# EAGLE design TVMC (EAGLE 4.13)
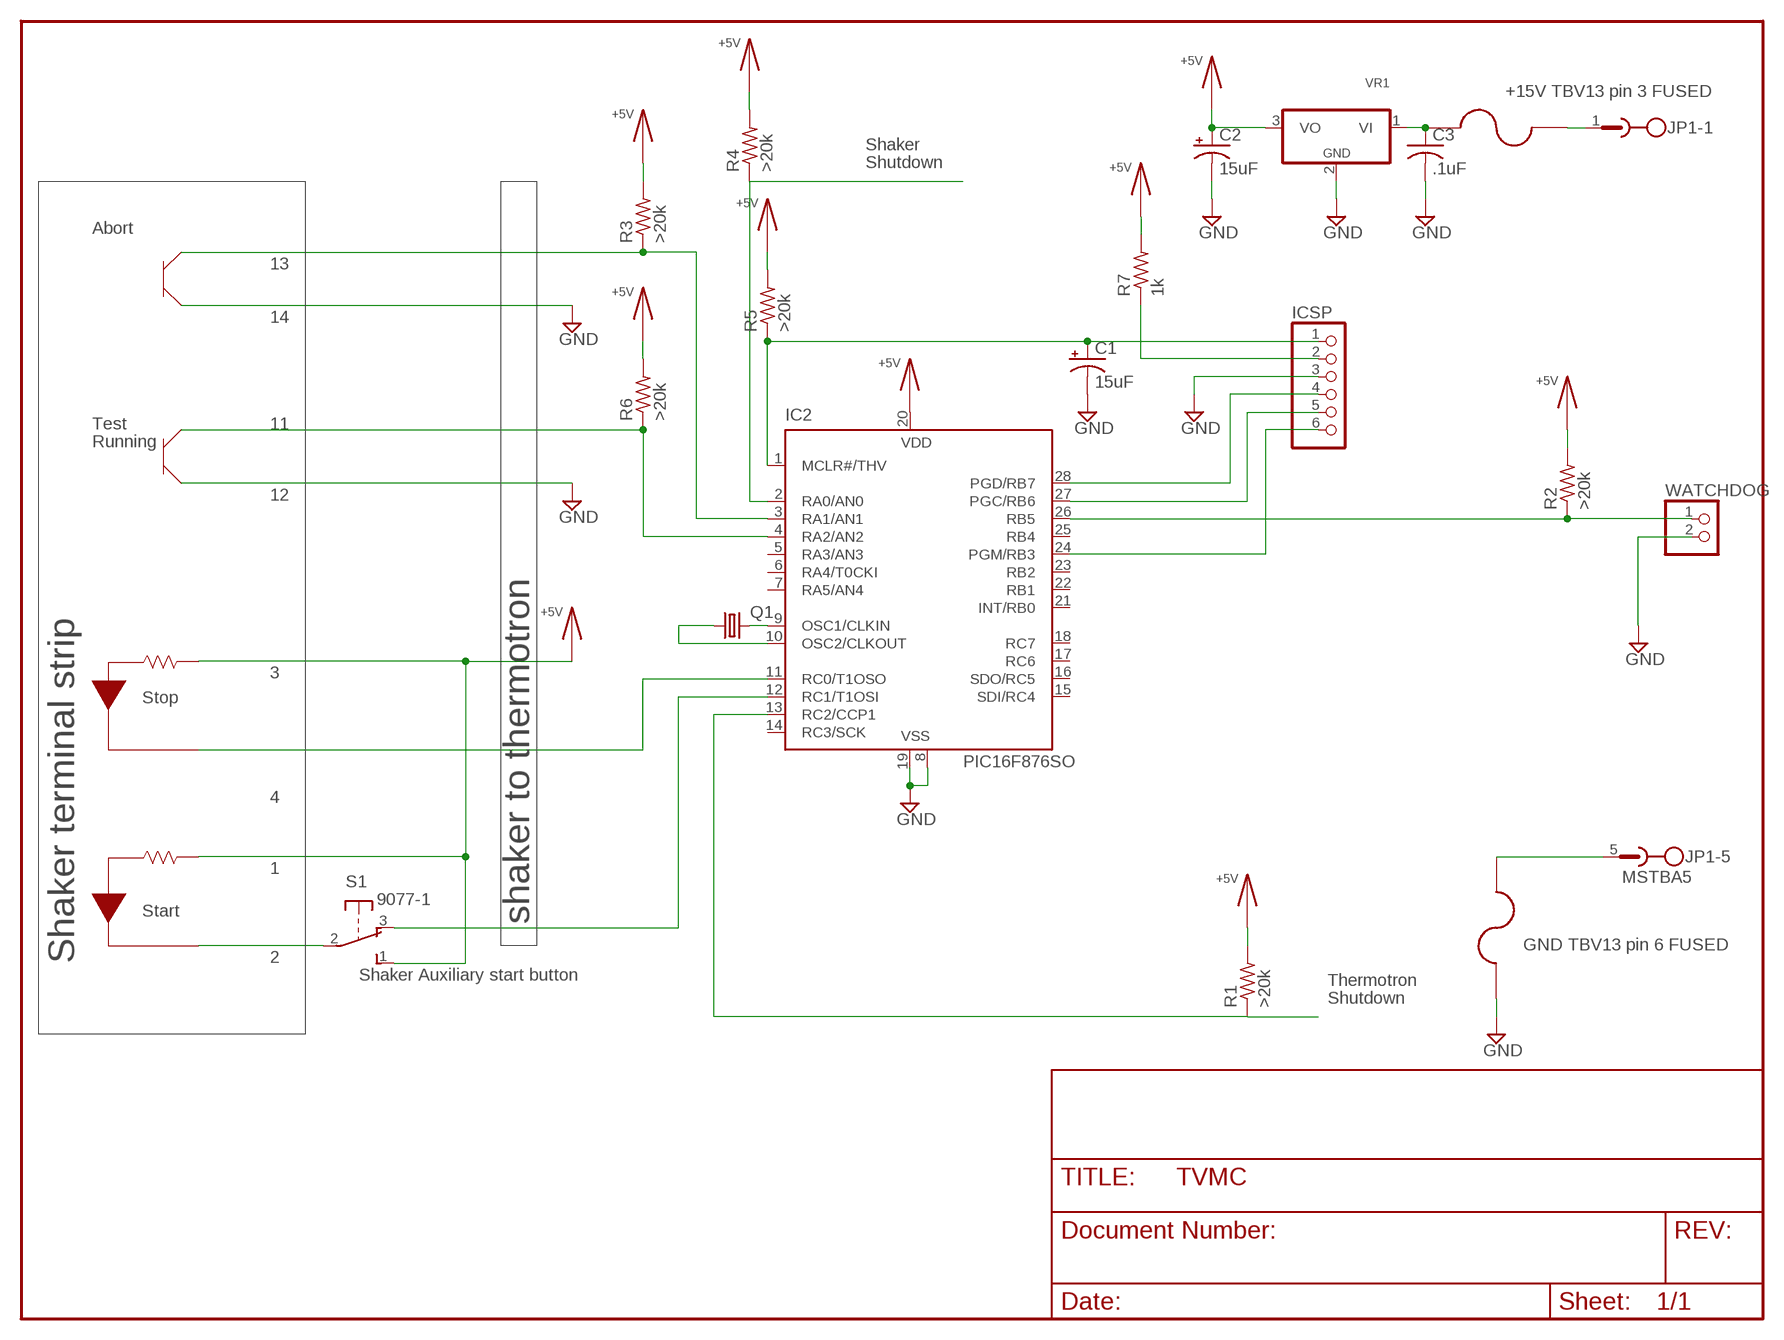
[diagram p0: schematic, sheet 1]

## Parts
C1  15uF  CAPACITOR-ELECTROLYTICG  [PANASONIC_G]
C2  15uF  CAPACITOR-ELECTROLYTICG  [PANASONIC_G]
C3  .1uF  CAPACITOR-NO-POLARITYC1206  [C1206]
IC2  PIC16F876SO  [SO-28W]
ICSP  PINHD-1X6  [1X06]
JP1  MSTBA5  [MSTBA5]
Q1  CRYSTALSM49  [SM49]
R1  >20k  RESISITORM1206  [M1206]
R2  >20k  RESISITORM1206  [M1206]
R3  >20k  RESISITORM1206  [M1206]
R4  >20k  RESISITORM1206  [M1206]
R5  >20k  RESISITORM1206  [M1206]
R6  >20k  RESISITORM1206  [M1206]
R7  1k  RESISITORM1206  [M1206]
S1  9077-1  [9077-1]
U$1  1/2 amp  FUSE(SM)  [FUSE]
U$3  FUSE(SM)  [FUSE]
VR1  VOLTAGE-REGULATORSO-223  [SOT223R_INFINEON]
WATCHDOG  PINHD-1X2  [1X02]

## Nets
14: IC2.3(RA1/AN1) R3.1
+5V: C2.+ IC2.20(VDD) R1.2 R2.2 R3.2 R4.2 R5.2 R6.2 R7.2 S1.1(S) VR1.3(VO)
GND: C1.- C2.- C3.2 IC2.8(VSS) IC2.19(VSS) ICSP.3 U$3.P$1 VR1.2(GND) WATCHDOG.2
N$1: IC2.2(RA0/AN0) R4.1
N$2: IC2.12(RC1/T1OSI) S1.3(O)
N$3: IC2.13(RC2/CCP1) R1.1
N$4: IC2.26(RB5) R2.1 WATCHDOG.1
N$5: IC2.4(RA2/AN2) R6.1
N$6: IC2.11(RC0/T1OSO)
N$7: IC2.9(OSC1/CLKIN) Q1.2
N$8: S1.2(P)
N$9: C3.1 U$1.P$1 VR1.1(VI)
N$10: IC2.10(OSC2/CLKOUT) Q1.1
N$12: C1.+ IC2.1(MCLR#/THV) ICSP.1 R5.1
N$13: ICSP.2 R7.1
N$14: JP1.5 U$3.P$2
N$15: JP1.1 U$1.P$2
N$16: IC2.28(PGD/RB7) ICSP.4
N$17: IC2.27(PGC/RB6) ICSP.5
N$18: IC2.24(PGM/RB3) ICSP.6
Unconnected: IC2.5(RA3/AN3) IC2.6(RA4/T0CKI) IC2.7(RA5/AN4) IC2.14(RC3/SCK) IC2.15(SDI/RC4) IC2.16(SDO/RC5) IC2.17(RC6) IC2.18(RC7) IC2.21(INT/RB0) IC2.22(RB1) IC2.23(RB2) IC2.25(RB4) JP1.2 JP1.3 JP1.4

## Notes on the sheet
- +15V TBV13 pin 3 FUSED
- Shaker
- Shutdown
- Abort
- 13
- 14
- Test | 11
- Running
- 12
- 3
- Stop
- 4
- 1
- Start
- shaker to thermotron
- GND TBV13 pin 6 FUSED
- Shaker terminal strip | 2
- Shaker Auxiliary start button
- Thermotron
- Shutdown

## Library data of the parts
C1 C2 = 1 Dan's Common Parts:CAPACITOR-ELECTROLYTIC: POLARIZED CAPACITOR, American symbol
C3 = 1 Dan's Common Parts:CAPACITOR-NO-POLARITY: CAPACITOR, American symbol
IC2 = 1 Dan's Common Parts:PIC16*876: MICROCONTROLLER flash type
ICSP = pinhead:PINHD-1X6: PIN HEADER
JP1 = con-phoenix-508:MSTBA5: PHOENIX
Q1 = 1 Dan's Common Parts:CRYSTAL: CRYSTAL
R1-R7 = 1 Dan's Common Parts:RESISITOR: RESISTOR, American symbol
S1 = switch-misc:9077-1: MARQUARDT SWITCH
U$1 U$3 = 1 Dan's Common Parts:FUSE(SM)
VR1 = 1 Dan's Common Parts:VOLTAGE-REGULATOR: Positive VOLTAGE REGULATOR Source: http://cache.national.com/ds/LM/LM78L05.pdf http://www.fairchildsemi.com/ds/LM/LM7805.pdf
WATCHDOG = pinhead:PINHD-1X2: PIN HEADER

## Board
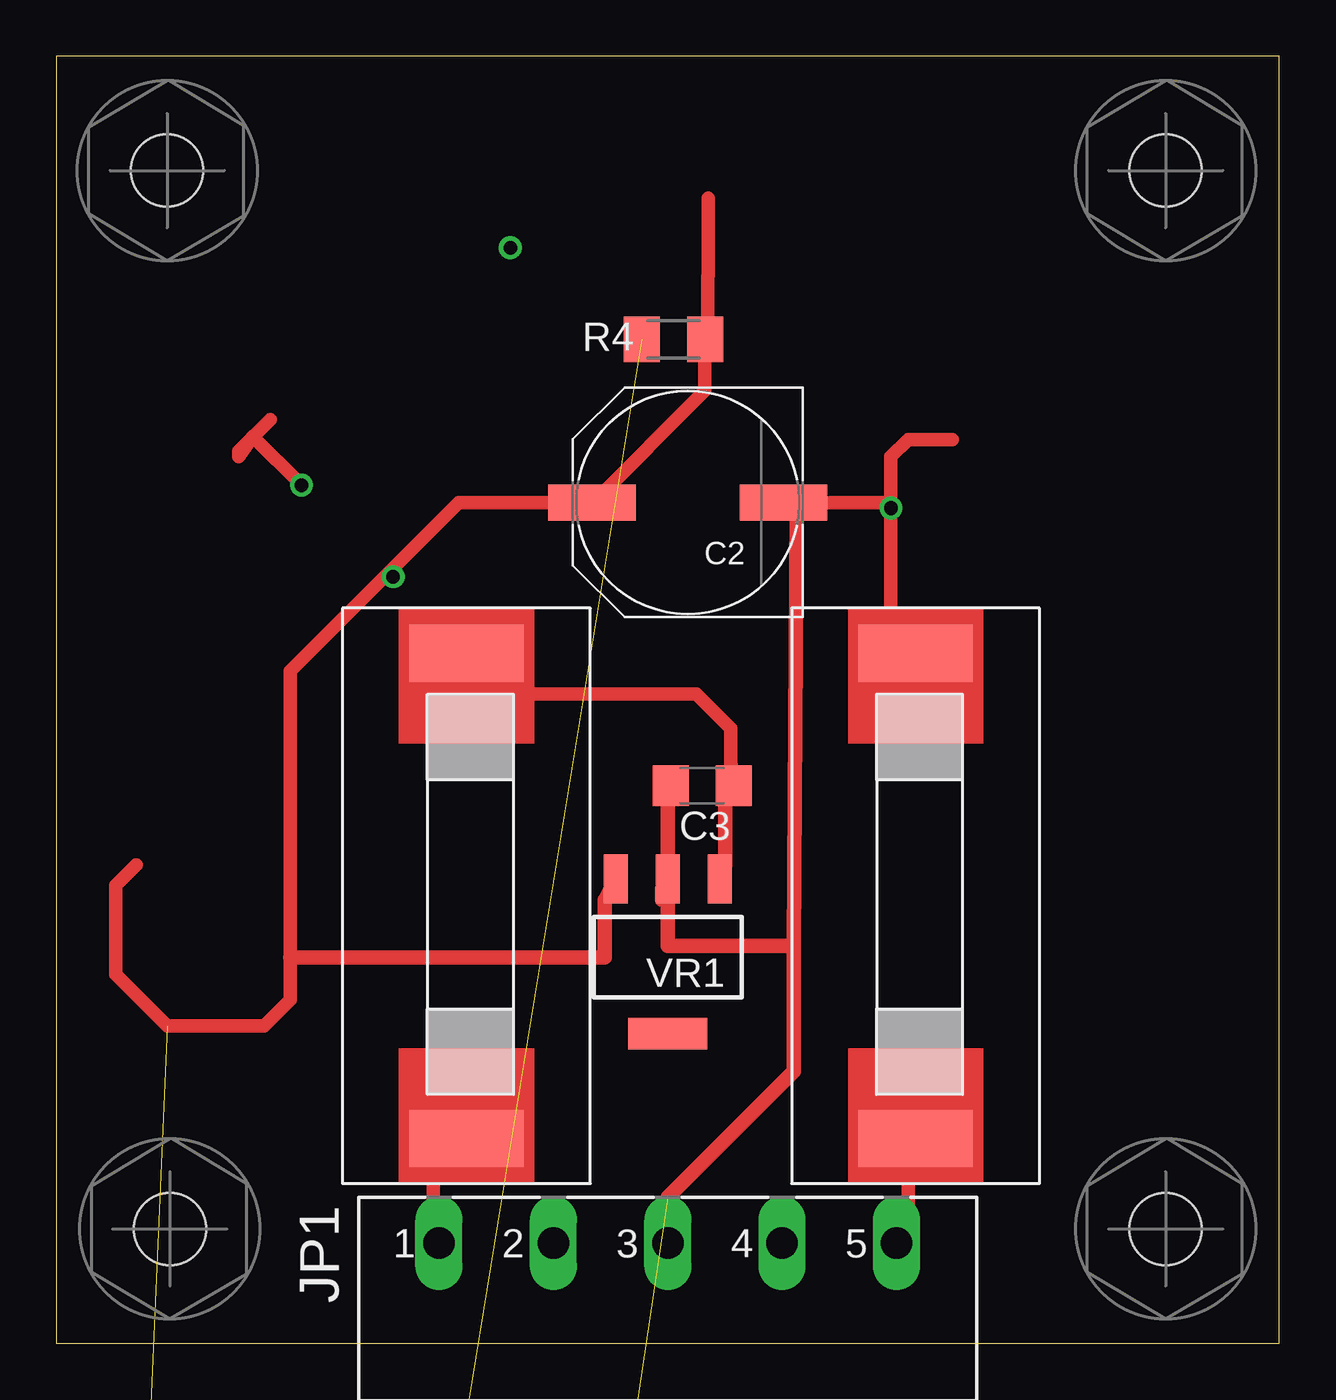
[diagram p1: board, top side]
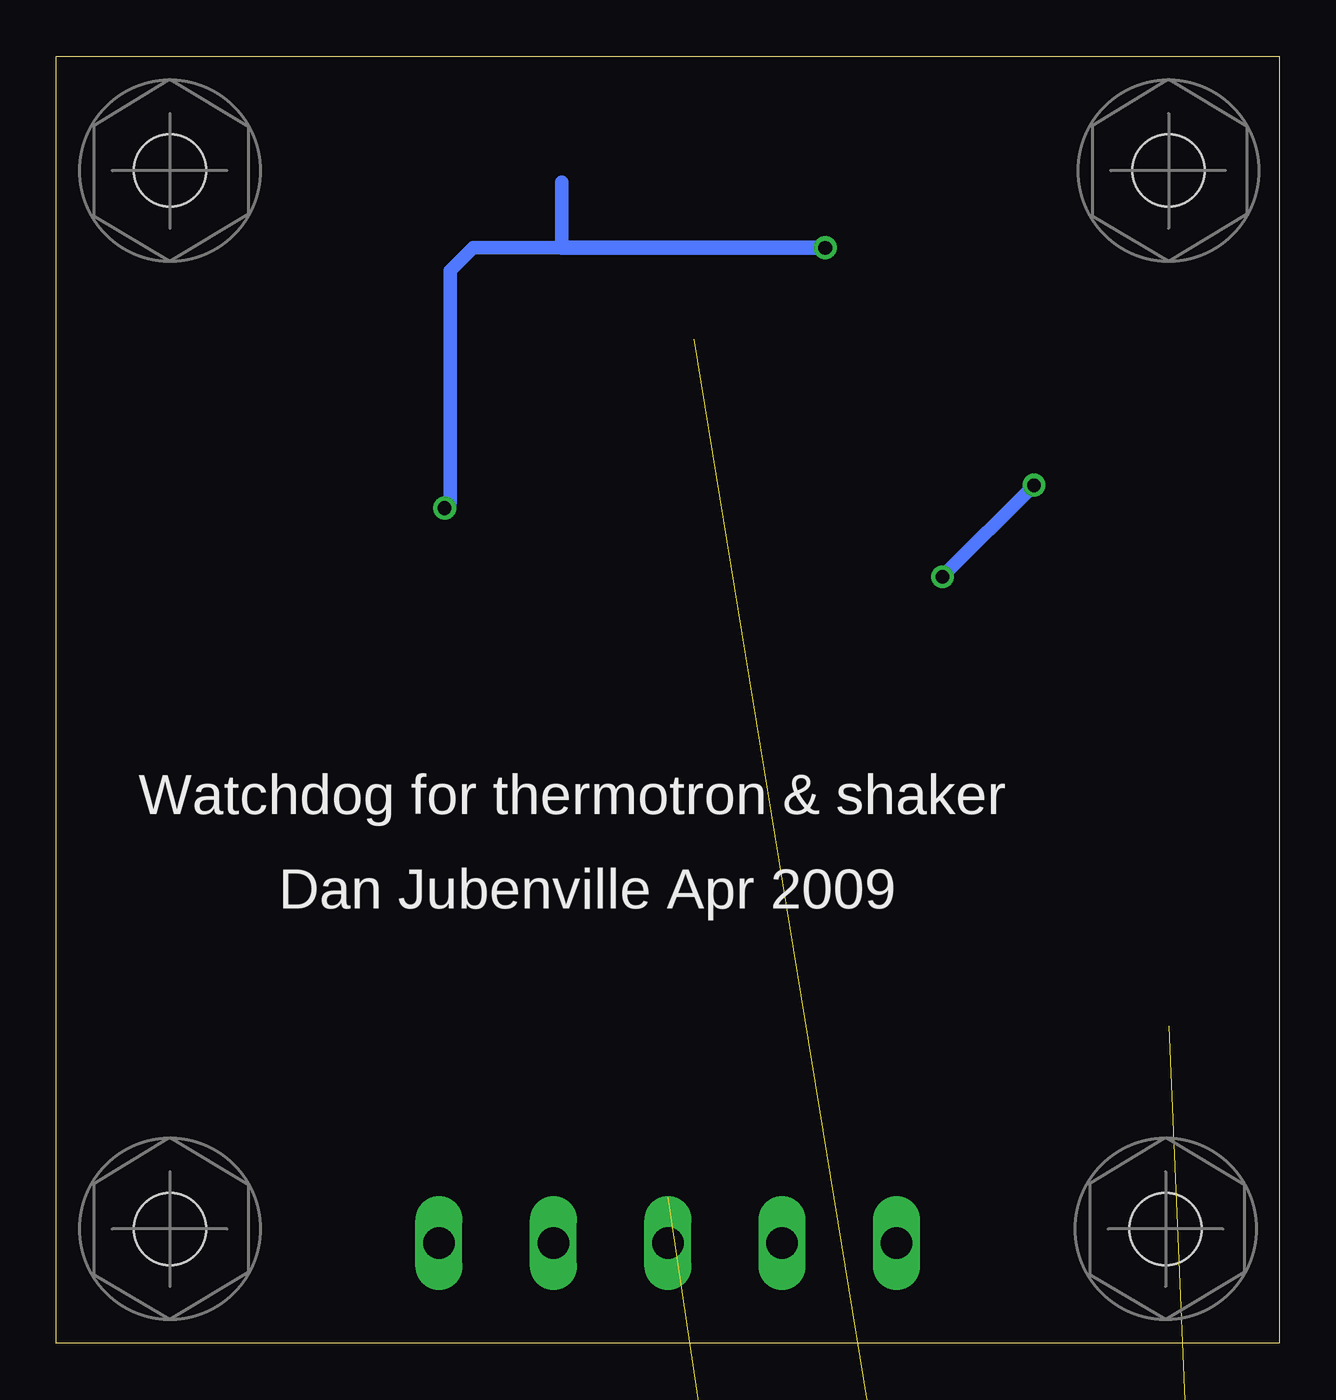
[diagram p2: board, bottom side, seen from below]

Size 54.28 x 57.14 mm. Coordinates in mm from the lower left corner, seen from the top.
Outline: 0,0 54.28,0 54.28,57.14 0,57.14 0,0
Copper layers (1*16): Top 0.035mm / dielectric 1.5mm / Bottom 0.035mm
Design rules "default": minimum track width 20mil, minimum drill 20mil, track to track 10mil, track to pad 10mil, pad to pad 10mil, via to via 10mil, smd to smd 0mil, copper to edge 20mil, drill to drill 8mil, minimum pad ring 10mil, minimum via ring 8mil, stop-mask expansion 4mil, vias tented up to drill 0mil, thermal gap 10mil
vRestrict: area 5,17.8 to 15.2,22.9

### Footprints (pad centres in the part's own frame; a part is rotated, then mirrored left to right if it is on the bottom)
PANASONIC_G = smd 3.9 x 1.6: + 4.25,0; - -4.25,0
C1206 = smd 1.6 x 1.8: 1 -1.4,0; 2 1.4,0
SO-28W = smd 0.762 x 1.27: 1 -7.62,-5.207; 2 -6.35,-5.207; 3 -5.08,-5.207; 4 -3.81,-5.207; 5 -2.54,-5.207; 6 -1.27,-5.207; 7 0,-5.207; 8 1.27,-5.207; 9 2.54,-5.207; 10 3.81,-5.207; 11 5.08,-5.207; 12 6.35,-5.207; 13 7.62,-5.207; 14 8.89,-5.207; 15 8.89,5.08; 16 7.62,5.08; 17 6.35,5.08; 18 5.08,5.08; 19 3.81,5.08; 20 2.54,5.08; 21 1.27,5.08; 22 0,5.08; 23 -1.27,5.08; 24 -2.54,5.08; 25 -3.81,5.08; 26 -5.08,5.08; 27 -6.35,5.08; 28 -7.62,5.08
1X06 = drill 1.016 long: 1 -6.35,0; 2 -3.81,0; 3 -1.27,0; 4 1.27,0; 5 3.81,0; 6 6.35,0
MSTBA5 = drill 1.397 long: 1 -10.16,5.08; 2 -5.08,5.08; 3 0,5.08; 4 5.08,5.08; 5 10.16,5.08
SM49 = smd 5.08 x 1.778: 1 -4.826,0; 2 4.826,0
M1206 = smd 1.6 x 2: 1 -1.4,0; 2 1.4,0
9077-1 = drill 0.813 long: 1 -2.54,-1.016; 2 0,-1.016; 3 2.54,-1.016
FUSE = smd 2.54 x 5.08: P$1 2,5.54; P$2 23.54,5.54
SCREW = hole 3.2: 0,0
SOT223R_INFINEON = smd 1.067 x 2.184: 1 -2.311,-3.479; 2 0,-3.48; 3 2.312,-3.48 | smd 3.5 x 1.4: 4 0,3.404
1X02 = drill 1.016 long: 1 -1.27,0; 2 1.27,0

### Placement (x,y rotation side)
C1  8.85,-156.22 0 top  (outside the outline)
C2  28.03,37.33 180 top
C3  28.66,24.76 180 top
IC2  11.39,-78.74 0 top  (outside the outline)
ICSP  10.12,-139.7 0 top  (outside the outline)
JP1  27.14,-0.64 0 top
Q1  10.12,-130.81 0 top  (outside the outline)
R1  5.04,-91.44 0 top  (outside the outline)
R2  5.04,-99.06 0 top  (outside the outline)
R3  5.04,-114.3 0 top  (outside the outline)
R4  27.39,44.57 0 top
R5  5.04,-147.32 0 top  (outside the outline)
R6  5.04,-121.92 0 top  (outside the outline)
R7  5.04,-165.1 0 top  (outside the outline)
S1  6.31,-11.44 0 top  (outside the outline)
U$1  12.66,32.63 270 top
U$2  [SCREW]  49.24,5.08 0 top
U$3  32.6,32.63 270 top
U$7  [SCREW]  5.04,5.08 0 top
U$8  [SCREW]  4.92,52.06 0 top
U$9  [SCREW]  49.24,52.06 0 top
VR1  27.14,17.14 180 top
WATCHDOG  5.04,-106.69 0 top  (outside the outline)

### Tracks (layer width: path | path; a pad name or v marks a point on that pad's centre or on a via)
14  (1 unrouted)
+5V  (via drill 0.61)  (8 unrouted)
  Top 0.61: 15.07,34.54 17.87,37.33 C2.+ 23.84,37.33 28.79,42.29 28.79,44.83 R4.2 28.92,44.7 28.92,47.37 28.94,47.39 28.94,50.85 | 14.88,34.35 10.38,29.84 10.38,17.14 10.38,15.23 9.23,14.09 4.92,14.09 2.63,16.38 2.63,20.32 3.55,21.24 | 14.88,34.35 15.07,34.54 | 14.88,34.35 14.82,34.16 | 9.49,41.02 8.09,39.62 8.09,39.37 8.09,39.36 8.72,40.26 v10.88,38.09 | v14.95,34.03 14.95,34.41 15.07,34.54
  Top 0.635: 10.38,17.14 24.35,17.14 24.35,19.68 VR1.3
  Bottom 0.61: v14.95,34.03 v10.88,38.09
GND  (via drill 0.61)  (5 unrouted)
  Top 0.61: 32.86,37.21 34.38,37.33 37.05,37.33 | 39.76,40.13 37.81,40.13 37.05,39.36 37.05,37.33 | 37.05,37.33 v37.05,37.08 37.05,30.33 U$3.P$1
  Top 0.635: 27.39,24.51 27.39,24.76 27.65,25.01 | 27.65,25.01 27.14,24.76 27.14,17.65 | 32.73,17.65 32.86,37.21 32.6,37.21 C2.- | 27.65,25.01 C3.2 27.14,24 VR1.2 26.89,20.19 26.89,19.68 27.14,19.93 27.14,17.65 | 27.14,6.47 32.73,12.06 32.73,17.65 | 32.73,17.65 27.14,17.65
  Bottom 0.61: v37.05,37.08 36.79,37.33 36.79,47.62 35.78,48.64 31.84,48.64 31.84,51.56
  Bottom 0.635: 31.84,48.64 v20.16,48.64
N$1  (1 unrouted)
N$2  (1 unrouted)
N$3  (1 unrouted)
N$4  (2 unrouted)
N$5  (1 unrouted)
N$7  (1 unrouted)
N$9
  Top 0.61: U$1.P$1 17.23,28.82 28.41,28.82 29.93,27.3 29.93,25.78 C3.1
  Top 0.635: VR1.1 29.43,20.7 29.68,21.2 29.68,24 C3.1
N$10  (1 unrouted)
N$12  (3 unrouted)
N$13  (1 unrouted)
N$14
  Top 0.61: U$3.P$2 38.06,10.54 37.81,10.03 37.81,4.69 37.55,4.44 JP1.5
N$15
  Top 0.61: U$1.P$2 15.96,11.55 16.73,11.04 16.73,4.19 JP1.1
N$16  (1 unrouted)
N$17  (1 unrouted)
N$18  (1 unrouted)

### Text on the board
bNames: Watchdog for thermotron & shaker | Dan Jubenville Apr 2009